# Altium schematic sheet Analizador_de_espectro.SchDoc
size A4
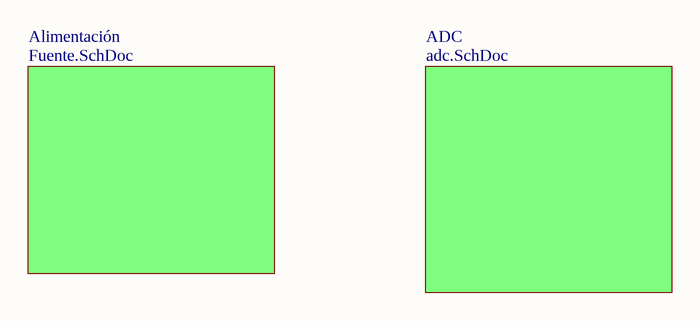
[diagram p0: Analizador_de_espectro.SchDoc]

## Sub-sheets
ADC = adc.SchDoc: no entries
Alimentación = Fuente.SchDoc: no entries